# Altium project dust-measure-device.PrjPcb
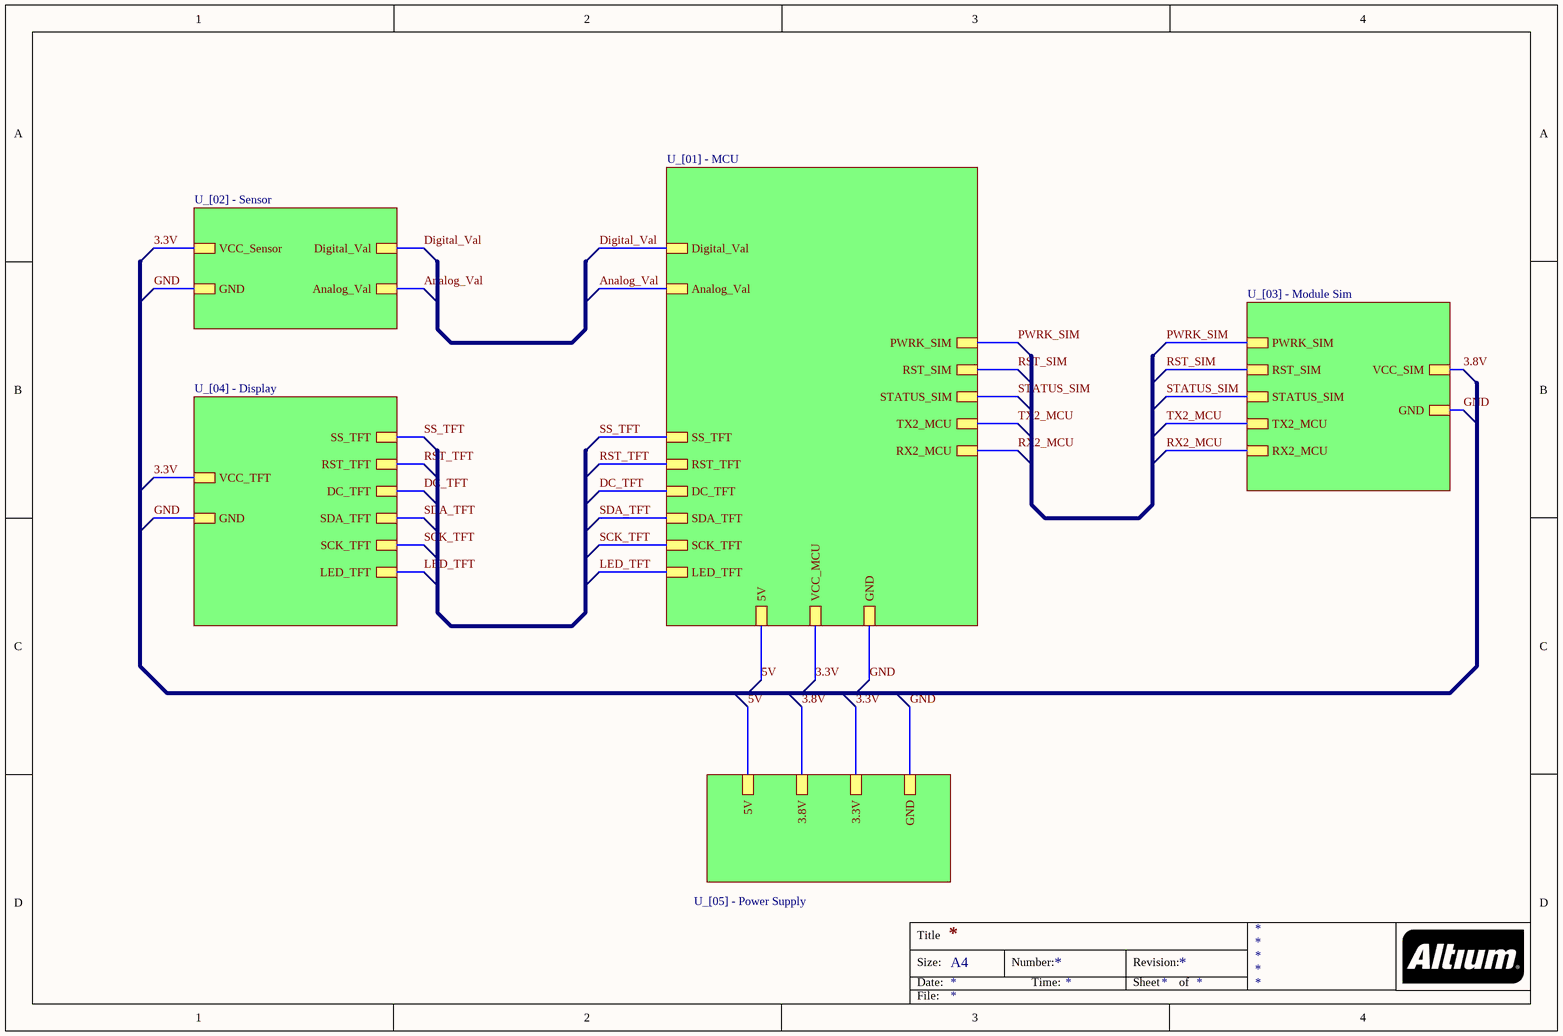
[diagram p0: [00] - Block Sheet.SchDoc]
6 sheets, 93 parts. Net scope: hierarchical (ports join the sheet entries above them; power ports are global).
Board file: dust-measure-device.PcbDoc
Sheets:
  [00] - Block Sheet.SchDoc
    U_[01] - MCU = [01] - MCU.SchDoc
    U_[02] - Sensor = [02] - Sensor.SchDoc
    U_[03] - Module Sim = [03] - Module Sim.SchDoc
    U_[04] - Display = [04] - Display.SchDoc
    U_[05] - Power Supply = [05] - Power Supply.SchDoc

## Sheet [00] - Block Sheet.SchDoc
size A4

### Sub-sheets
U_[01] - MCU = [01] - MCU.SchDoc: 5V, VCC_MCU, GND, TX2_MCU, RX2_MCU, PWRK_SIM, RST_SIM, STATUS_SIM, Analog_Val, Digital_Val, SS_TFT, SCK_TFT, SDA_TFT, RST_TFT, DC_TFT, LED_TFT
U_[02] - Sensor = [02] - Sensor.SchDoc: VCC_Sensor, GND, Digital_Val, Analog_Val
U_[03] - Module Sim = [03] - Module Sim.SchDoc: VCC_SIM, PWRK_SIM, RST_SIM, GND, STATUS_SIM, TX2_MCU, RX2_MCU
U_[04] - Display = [04] - Display.SchDoc: VCC_TFT, GND, SS_TFT, RST_TFT, DC_TFT, SDA_TFT, SCK_TFT, LED_TFT
U_[05] - Power Supply = [05] - Power Supply.SchDoc: 3.3V, GND, 5V, 3.8V

### Nets
3.3V: sheet U_[01] - MCU/VCC_MCU, sheet U_[02] - Sensor/VCC_Sensor, sheet U_[04] - Display/VCC_TFT, sheet U_[05] - Power Supply/3.3V
3.8V: sheet U_[03] - Module Sim/VCC_SIM, sheet U_[05] - Power Supply/3.8V
5V: sheet U_[01] - MCU/5V, sheet U_[05] - Power Supply/5V
GND: sheet U_[01] - MCU/GND, sheet U_[02] - Sensor/GND, sheet U_[03] - Module Sim/GND, sheet U_[04] - Display/GND, sheet U_[05] - Power Supply/GND
Analog_Val: sheet U_[01] - MCU/Analog_Val, sheet U_[02] - Sensor/Analog_Val
DC_TFT: sheet U_[01] - MCU/DC_TFT, sheet U_[04] - Display/DC_TFT
Digital_Val: sheet U_[01] - MCU/Digital_Val, sheet U_[02] - Sensor/Digital_Val
LED_TFT: sheet U_[01] - MCU/LED_TFT, sheet U_[04] - Display/LED_TFT
PWRK_SIM: sheet U_[01] - MCU/PWRK_SIM, sheet U_[03] - Module Sim/PWRK_SIM
RST_SIM: sheet U_[01] - MCU/RST_SIM, sheet U_[03] - Module Sim/RST_SIM
RST_TFT: sheet U_[01] - MCU/RST_TFT, sheet U_[04] - Display/RST_TFT
RX2_MCU: sheet U_[01] - MCU/RX2_MCU, sheet U_[03] - Module Sim/RX2_MCU
SCK_TFT: sheet U_[01] - MCU/SCK_TFT, sheet U_[04] - Display/SCK_TFT
SDA_TFT: sheet U_[01] - MCU/SDA_TFT, sheet U_[04] - Display/SDA_TFT
SS_TFT: sheet U_[01] - MCU/SS_TFT, sheet U_[04] - Display/SS_TFT
STATUS_SIM: sheet U_[01] - MCU/STATUS_SIM, sheet U_[03] - Module Sim/STATUS_SIM  [project net STATUS]
TX2_MCU: sheet U_[01] - MCU/TX2_MCU, sheet U_[03] - Module Sim/TX2_MCU

### Notes on the sheet
- Title
- Size:
- Date:
- A4
- Number:
- Time:
- Revision:
- Sheet
- of
- File:

## Sheet [01] - MCU.SchDoc
size B
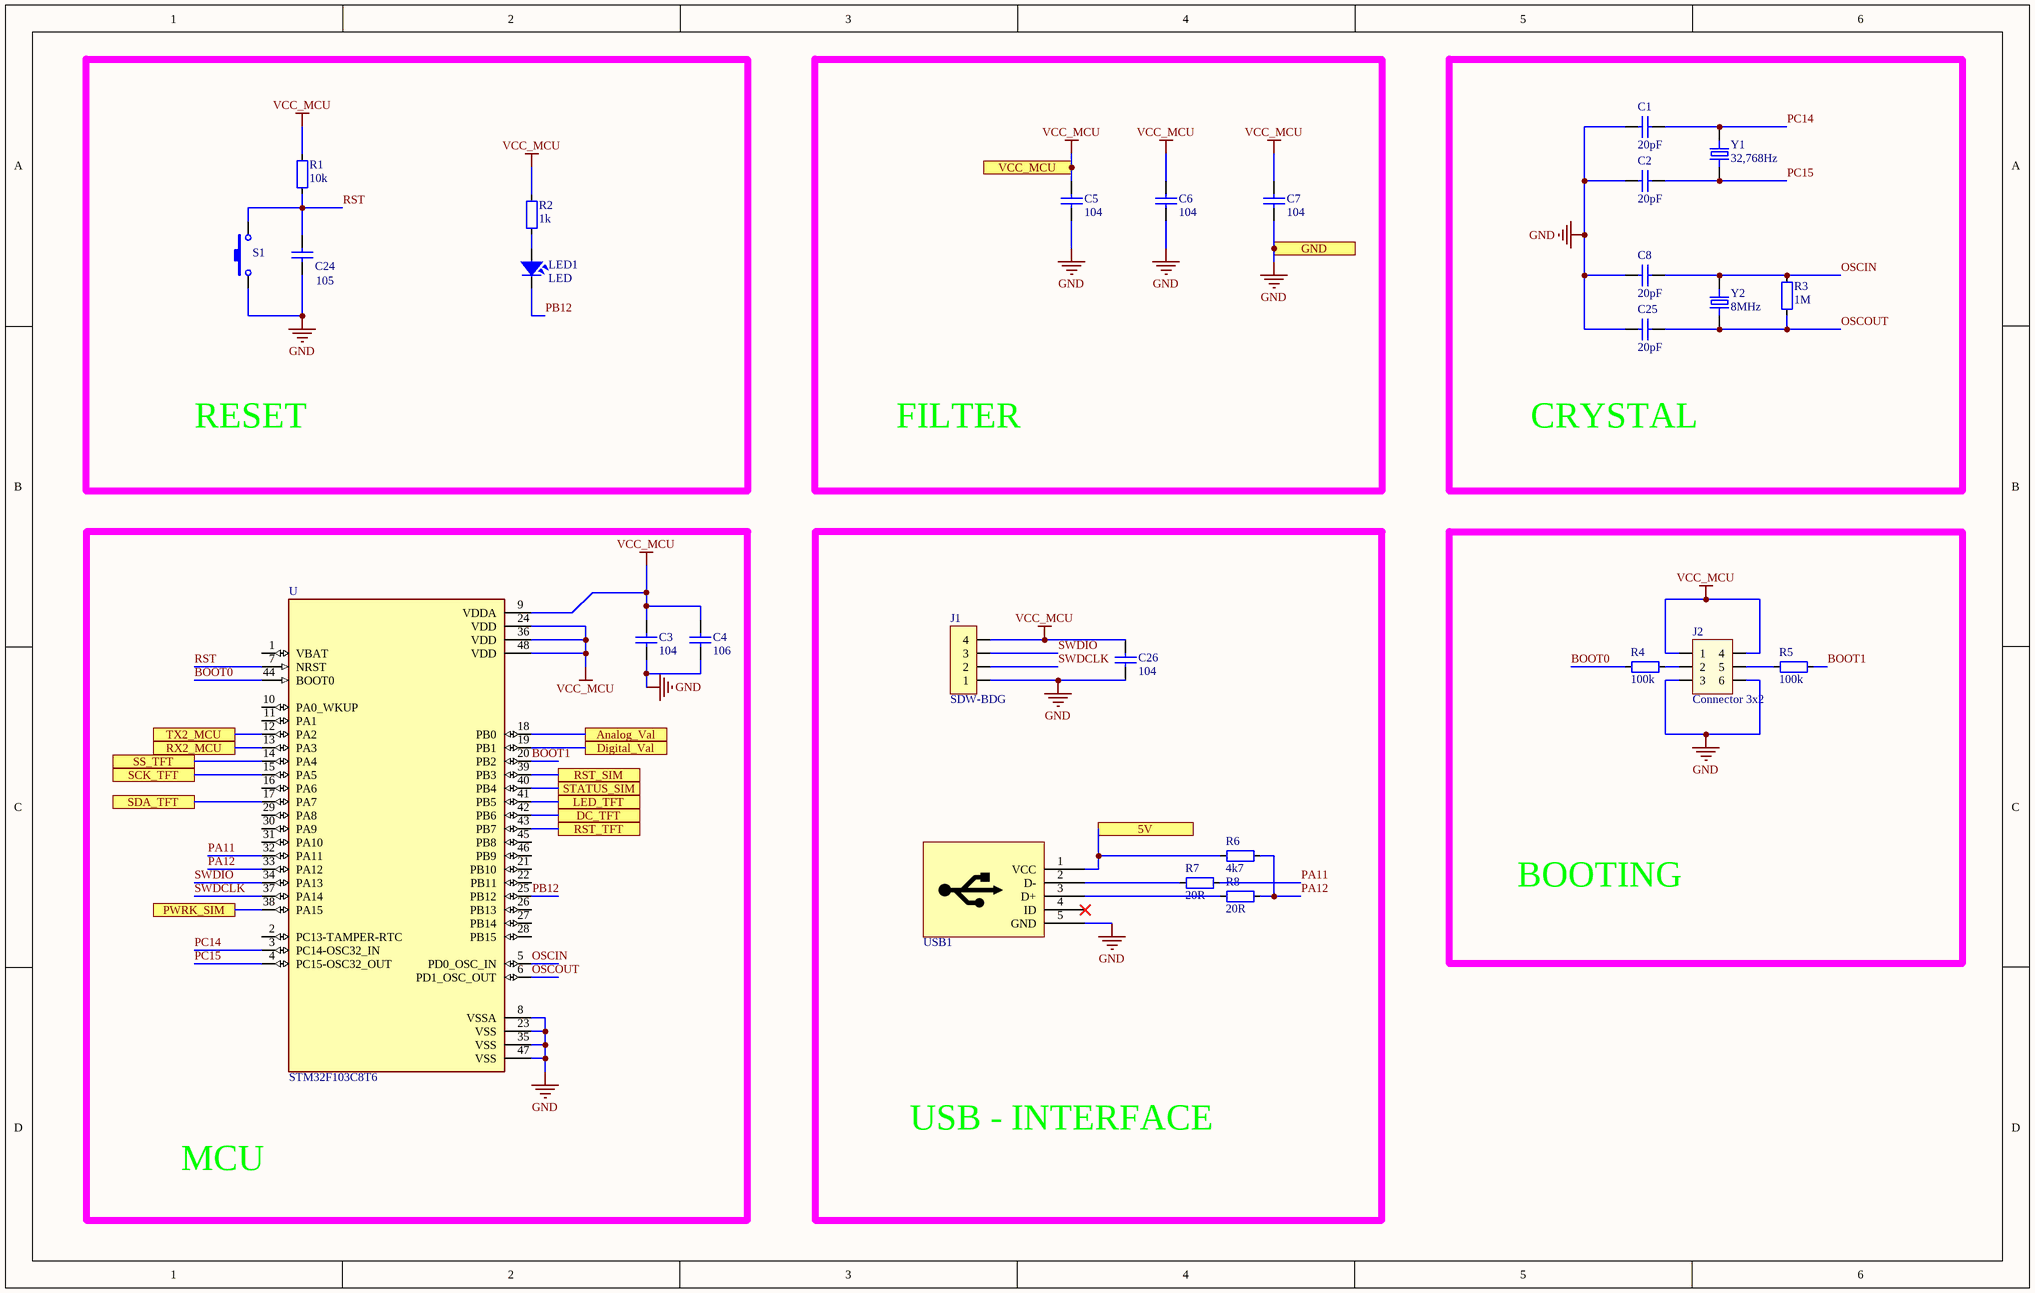
[diagram p1: [01] - MCU.SchDoc]

### Parts
C1  20pF  [CAP_0805]
C2  20pF  [CAP_0805]
C3  104  [CAP_0603]
C4  106  [CAP_1206]
C5  104  [CAP_0603]
C6  104  [CAP_0603]
C7  104  [CAP_0603]
C8  20pF  [CAP_0805]
C24  105  [CAP_0603]
C25  20pF  [CAP_0805]
C26  104  [CAP_0603]
J1  SDW-BDG  [JP4-D1C]
J2  Connector 3x2  [JP3x2]
LED1  LED  [LED-0805-Red]
R1  10k  [RES-SMD-0603]
R2  1k  [RES-SMD-0603]
R3  1M  [RES-SMD-0603]
R4  100k  [RES-SMD-0603]
R5  100k  [RES-SMD-0603]
R6  4k7  [RES-SMD-0603]
R7  20R  [RES-SMD-0603]
R8  20R  [RES-SMD-0603]
S1  SW-SMD  [SW 3x2x4]  (value not drawn)
U  STM32F103C8T6  [STM32F103C8T6]
USB1  USB  [USB-M1]  (value not drawn)
Y1  32,768Hz  [XTAL_ABLS-20.000MHZ-B4-T]
Y2  8MHz  [XTAL_ABLS-20.000MHZ-B4-T]

### Ports
5V, Analog_Val, DC_TFT, Digital_Val, GND, LED_TFT, PWRK_SIM, RST_SIM, RST_TFT, RX2_MCU, SCK_TFT, SDA_TFT, SS_TFT, STATUS_SIM, TX2_MCU, VCC_MCU

### Nets
5V: R6.2 USB1.1(VCC) ; port 5V
GND: C1.1 C2.1 C3.1 C4.1 C5.1 C6.1 C7.1 C8.1 C24.1 C25.1 C26.1 J1.1 J2.3 J2.6 S1.1 U.8(VSSA) U.23(VSS) U.35(VSS) U.47(VSS) USB1.5(GND) ; port GND
VCC_MCU: C3.2 C4.2 C5.2 C6.2 C7.2 C26.2 J1.4 J2.1 J2.4 R1.2 R2.2 U.9(VDDA) U.24(VDD) U.36(VDD) U.48(VDD) ; port VCC_MCU  [project net 3.3V]
Analog_Val: U.18(PB0) ; port Analog_Val
BOOT0: R4.1 U.44(BOOT0)
BOOT1: R5.2 U.20(PB2)
DC_TFT: U.42(PB6) ; port DC_TFT
Digital_Val: U.19(PB1) ; port Digital_Val
LED_TFT: U.41(PB5) ; port LED_TFT
OSCIN: C8.2 R3.2 U.5(PD0_OSC_IN) Y2.2
OSCOUT: C25.2 R3.1 U.6(PD1_OSC_OUT) Y2.1
PA11: R7.2 U.32(PA11)
PA12: R6.1 R8.2 U.33(PA12)
PB12: LED1.2 U.25(PB12)
PC14: C1.2 U.3(PC14-OSC32_IN) Y1.2
PC15: C2.2 U.4(PC15-OSC32_OUT) Y1.1
PWRK_SIM: U.38(PA15) ; port PWRK_SIM
RST: C24.2 R1.1 S1.2 U.7(NRST)
RST_SIM: U.39(PB3) ; port RST_SIM
RST_TFT: U.43(PB7) ; port RST_TFT
RX2_MCU: U.13(PA3) ; port RX2_MCU
SCK_TFT: U.15(PA5) ; port SCK_TFT
SDA_TFT: U.17(PA7) ; port SDA_TFT
SS_TFT: U.14(PA4) ; port SS_TFT
STATUS: U.40(PB4) ; port STATUS_SIM
SWDCLK: J1.2 U.37(PA14)
SWDIO: J1.3 U.34(PA13)
TX2_MCU: U.12(PA2) ; port TX2_MCU
NetJ2_2: J2.2 R4.2
NetJ2_5: J2.5 R5.1
NetLED1_1: LED1.1 R2.1
NetR7_1: R7.1 USB1.2(D-)
NetR8_1: R8.1 USB1.3(D+)

Not connected (* = marked no-connect by the designer): U 1(VBAT) 2(PC13-TAMPER-RTC) 10(PA0_WKUP) 11(PA1) 16(PA6) 21(PB10) 22(PB11) 26(PB13) 27(PB14) 28(PB15) 29(PA8) 30(PA9) 31(PA10) 45(PB8) 46(PB9); USB1 4(ID)*

### Notes on the sheet
- RESET
- FILTER
- CRYSTAL
- BOOTING
- MCU
- USB - INTERFACE
- Title
- Size:
- Date:
- Orcad B
- Number:
- Time:
- Revision:
- Sheet
- of
- File:

### Library data of the parts
C1-C8 C24-C26 = CapSMD: Capacitor; Value: 33p; Published: 8-Jun-2000; LatestRevisionDate: 17-Jul-2002; LatestRevisionNote: Re-released for DXP Platform.; PackageReference: RAD-0.3; Publisher: Altium Limited
J1 = JP4: WR-PHD 2.54 mm Angled Socket Header; Manufacturer: W¨¹rth Elektronik eiSos GmbH; partNo: 613004143121; ComponentLink1 Description: Manufacturer; ComponentLink2 Description: Datasheet; NoPins: 04; Created Date: 29 March 2013; ComponentLink1URL: http://www.we-online.com; ComponentLink2URL: http://katalog.we-online.de/em/datasheet/6130xx143121.pdf; Created by: Karrer Zheng
J2 = JP3x2: Value: Connector 3x2
LED1 = LED: LED Single colour Green and Red; Value: LED 3 ly Single Colour
R1-R8 = Resistor - SMD: Resistor; Manufacturer: Generic Components; Class: Passive; Published: 08/06/2000; Publisher: Altium Hobart Technology Centre
S1 = SW-SMD: Switch; Published: 24-Mar-1999; LatestRevisionDate: 17-Jul-2002; LatestRevisionNote: Re-released for DXP Platform.; PackageReference: SPST-2; Publisher: Altium Limited; ComponentLink1Description: https://shopee.vn/-Home-Living-100pcs-3X6X2.5mm-Tactile-Push-Button-Switch-Tact-Switch-Micro-Switch-SMD-i.329424082.5262213627; ComponentLink1URL: https://shopee.vn/-Home-Living-100pcs-3X6X2.5mm-Tactile-Push-Button-Switch-Tact-Switch-Micro-Switch-SMD-i.329424082.5262213627
U = STM32F103C8T6: ARMÂ® CortexÂ®-M3 STM32F1 Microcontroller IC 32-Bit 72MHz 64KB _64K x 8_ FLASH; MF: STMicroelectronics; Price: None; Package: LQFP-48 STMicroelectronics; Value: *; MP: STM32F103C8T6; Availability: Unavailable; SnapEDA_Link: https://www.snapeda.com/parts/STM32F103C8T6/STMicroelectronics/view-part/52195/?ref=snap
USB1 = USB-micro
Y1 Y2 = Crystal: 8MHz Â±20ppm Crystal 18pF 80 Ohms HC-49/US; MP: ABLS-8.000MHZ-B2; MF: Abracon LLC; Value: *; Package: HC-49/US Abracon LLC; SnapEDA_Link: https://www.snapeda.com/parts/ABLS-8.000MHZ-B2/Abracon%20LLC/view-part/2753215/?ref=snap; Price: None; Availability: Unavailable

## Sheet [02] - Sensor.SchDoc
size A
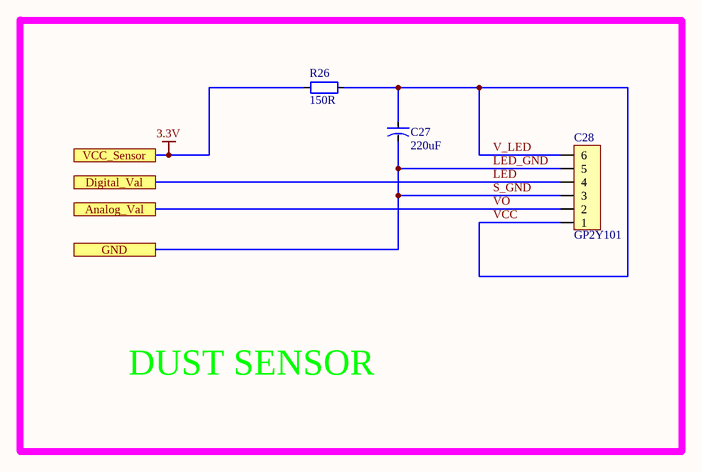
[diagram p2: [02] - Sensor.SchDoc]

### Parts
C27  220uF  [CAP-ALU-SMD-D]
C28  GP2Y101  [CON_6P]
R26  150R  [RES-SMD-0603]

### Ports
Analog_Val, Digital_Val, GND, VCC_Sensor

### Nets
3.3V: R26.1 ; port VCC_Sensor
LED_GND: C27.2 C28.3 C28.5 ; port GND  [also labelled S_GND]  [project net GND]
LED: C28.4 ; port Digital_Val  [project net Digital_Val]
V_LED: C27.1 C28.1 C28.6 R26.2  [also labelled VCC]
VO: C28.2 ; port Analog_Val  [project net Analog_Val]

### Notes on the sheet
- DUST SENSOR

### Library data of the parts
C27 = CAP-ALU-SMD: Polarized Capacitor (Axial); Published: 8-Jun-2000; LatestRevisionDate: 17-Jul-2002; LatestRevisionNote: Re-released for DXP Platform.; PackageReference: POLAR0.8; Publisher: Altium Limited
C28 = Header6: Header IDC, 6 x 1 Pin Vertical 2.54mm Pitch (Non-Boxed, Male); Manufacturer: W¨¹rth Elektronik eiSos GmbH; partNo: 613002143121; ComponentLink1 Description: Manufacturer; ComponentLink2 Description: Datasheet; NoPins: 02; Created Date: 29 March 2013; ComponentLink1URL: http://www.we-online.com; ComponentLink2URL: http://katalog.we-online.de/em/datasheet/6130xx143121.pdf; Created by: Karrer Zheng
R26 = Resistor - SMD: as R1 on sheet [01] - MCU; Published: 08/06/2000; Publisher: Altium Hobart Technology Centre

## Sheet [03] - Module Sim.SchDoc
size 381 x 266 mm
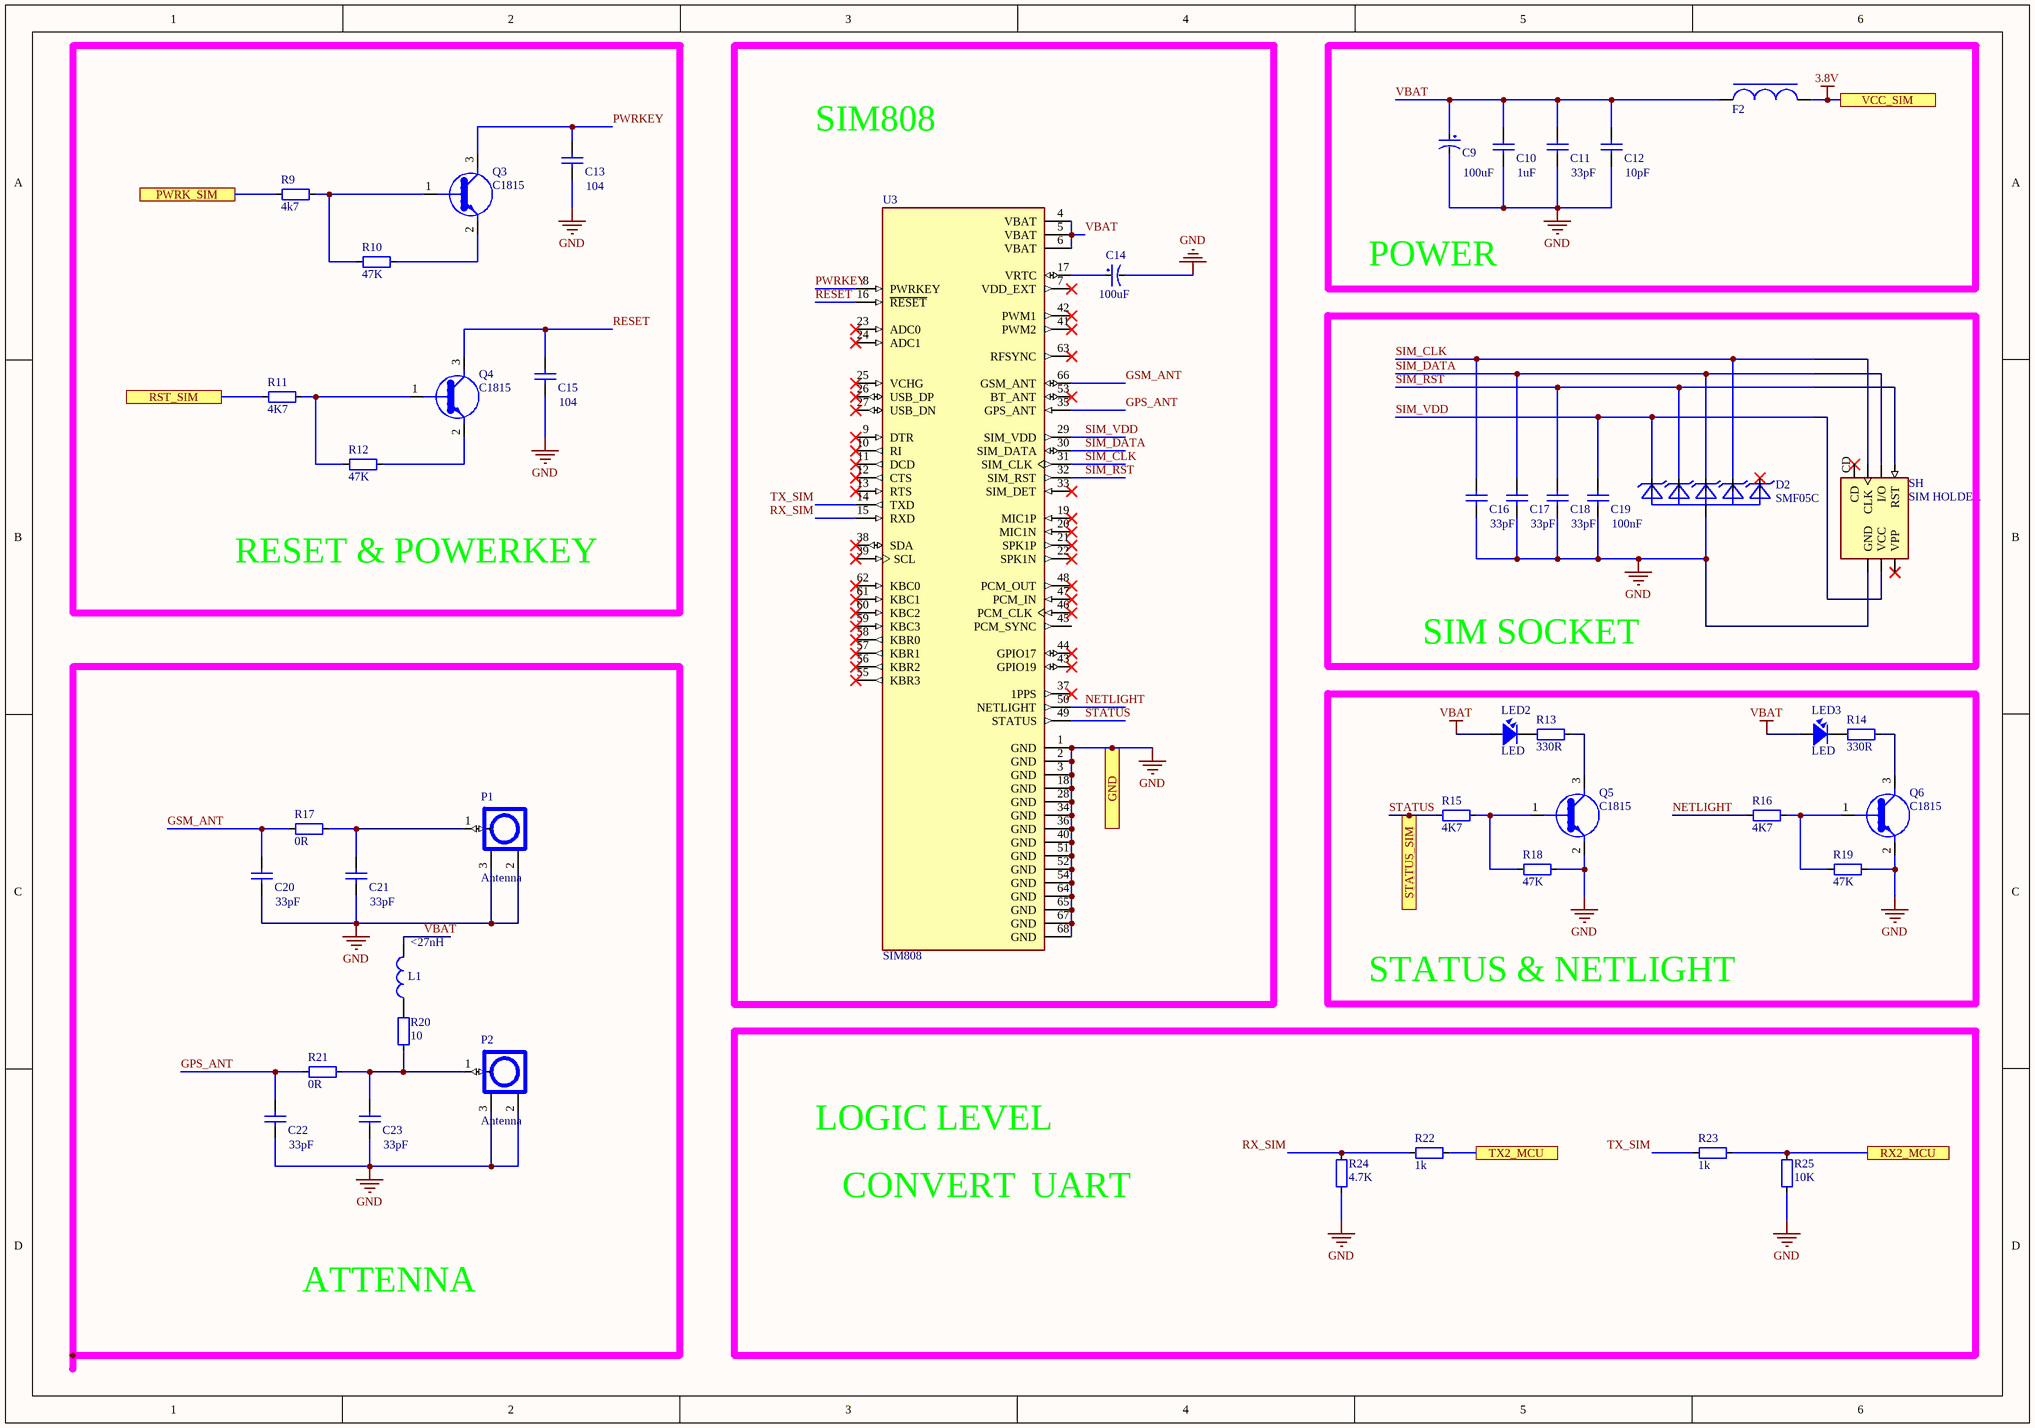
[diagram p3: [03] - Module Sim.SchDoc]

### Parts
C9  100uF  [CAP-ALU-SMD-D]
C10  1uF  [CAP_0805]
C11  33pF  [CAP_0805]
C12  10pF  [CAP_0805]
C13  104  [CAP_0805]
C14  100uF  [CAP-ALU-SMD-D]
C15  104  [CAP_0805]
C16  33pF  [CAP_0805]
C17  33pF  [CAP_0805]
C18  33pF  [CAP_0805]
C19  100nF  [CAP_0805]
C20  33pF  [CAP_0805]
C21  33pF  [CAP_0805]
C22  33pF  [CAP_0805]
C23  33pF  [CAP_0805]
D2  SMF05C  [SC70-6L]
F2  Ferrite Bead  [Ferrite_0805]  (value not drawn)
L1  <27nH  [L-SMD-D-7.3x7.3]
LED2  LED  [LED-0805-Red]
LED3  LED  [LED-0805-Red]
P1  Antenna  [IPXS]
P2  Antenna  [IPXS]
Q3  C1815  [SOT23]
Q4  C1815  [SOT23]
Q5  C1815  [SOT23]
Q6  C1815  [SOT23]
R9  4k7  [RES-SMD-0805]
R10  47K  [RES-SMD-0805]
R11  4K7  [RES-SMD-0805]
R12  47K  [RES-SMD-0805]
R13  330R  [RES-SMD-0805]
R14  330R  [RES-SMD-0805]
R15  4K7  [RES-SMD-0805]
R16  4K7  [RES-SMD-0805]
R17  0R  [RES-SMD-0603]
R18  47K  [RES-SMD-0805]
R19  47K  [RES-SMD-0805]
R20  10  [RES-SMD-0603]
R21  0R  [RES-SMD-0603]
R22  1k  [RES-SMD-0805]
R23  1k  [RES-SMD-0805]
R24  4.7K  [RES-SMD-0805]
R25  10K  [RES-SMD-0805]
SH  SIM HOLDER  [GCT_SIM7100-6-1-15-00-A_REVC]
U3  SIM808  [XCVR_SIM808]

### Ports
GND, PWRK_SIM, RST_SIM, RX2_MCU, STATUS_SIM, TX2_MCU, VCC_SIM

### Nets
3.8V: F2.2 ; port VCC_SIM
GND: C9.2 C10.1 C11.1 C12.1 C13.1 C14.2 C15.1 C16.1 C17.1 C18.1 C19.1 C20.1 C21.1 C22.1 C23.1 D2.2(A) P1.2 P1.3 P2.2 P2.3 Q5.2(E) Q6.2(E) R18.2 R19.2 R24.1 R25.2 SH.C5(GND) U3.1(GND) U3.2(GND) U3.3(GND) U3.18(GND) U3.28(GND) U3.34(GND) U3.36(GND) U3.40(GND) U3.51(GND) U3.52(GND) U3.54(GND) U3.64(GND) U3.65(GND) U3.67(GND) U3.68(GND) ; port GND
VBAT: C9.1 C10.2 C11.2 C12.2 F2.1 L1.2 LED2.1 LED3.1 U3.4(VBAT) U3.5(VBAT) U3.6(VBAT)
GPS_ANT: C22.2 R21.1 U3.35(GPS_ANT)
GSM_ANT: C20.2 R17.1 U3.66(GSM_ANT)
NETLIGHT: R16.1 U3.50(NETLIGHT)
PWRK_SIM: R9.1 ; port PWRK_SIM
PWRKEY: C13.2 Q3.3(C) U3.8(PWRKEY)
RESET: C15.2 Q4.3(C) U3.16(~{RESET})
RST_SIM: R11.1 ; port RST_SIM
RX2_MCU: R23.1 R25.1 ; port RX2_MCU
RX_SIM: R22.2 R24.2 U3.15(RXD)
SIM_CLK: C16.2 D2.5(C4) SH.C3(CLK) U3.31(SIM_CLK)
SIM_DATA: C17.2 D2.4(C3) SH.C7(I/O) U3.30(SIM_DATA)
SIM_RST: C18.2 D2.3(C2) SH.C2(RST) U3.32(SIM_RST)
SIM_VDD: C19.2 D2.1(C1) SH.C1(VCC) U3.29(SIM_VDD)
STATUS: R15.2 U3.49(STATUS) ; port STATUS_SIM
TX2_MCU: R22.1 ; port TX2_MCU
TX_SIM: R23.2 U3.14(TXD)
NetC14_1: C14.1 U3.17(VRTC)
NetC21_2: C21.2 P1.1 R17.2
NetC23_2: C23.2 P2.1 R20.1 R21.2
NetL1_1: L1.1 R20.2
NetLED2_2: LED2.2 R13.1
NetLED3_2: LED3.2 R14.1
NetQ3_1: Q3.1(B) R9.2 R10.1
NetQ3_2: Q3.2(E) R10.2
NetQ4_1: Q4.1(B) R11.2 R12.1
NetQ4_2: Q4.2(E) R12.2
NetQ5_1: Q5.1(B) R15.1 R18.1
NetQ5_3: Q5.3(C) R13.2
NetQ6_1: Q6.1(B) R16.2 R19.1
NetQ6_3: Q6.3(C) R14.2

Not connected (* = marked no-connect by the designer): D2 6(C5)*; SH C6(VPP)* CD*; U3 7(VDD_EXT)* 9(DTR)* 10(RI)* 11(DCD)* 12(CTS)* 13(RTS)* 19(MIC1P)* 20(MIC1N)* 21(SPK1P)* 22(SPK1N)* 23(ADC0)* 24(ADC1)* 25(VCHG)* 26(USB_DP)* 27(USB_DN)* 33(SIM_DET)* 37(1PPS)* 38(SDA)* 39(SCL)* 41(PWM2)* 42(PWM1)* 43(GPIO19)* 44(GPIO17)* 45(PCM_SYNC) 46(PCM_CLK)* 47(PCM_IN)* 48(PCM_OUT)* 53(BT_ANT)* 55(KBR3)* 56(KBR2)* 57(KBR1)* 58(KBR0)* 59(KBC3)* 60(KBC2)* 61(KBC1)* 62(KBC0)* 63(RFSYNC)*

### Notes on the sheet
- SIM808
- POWER
- RESET & POWERKEY
- SIM SOCKET
- STATUS & NETLIGHT
- LOGIC LEVEL
- CONVERT
- UART
- ATTENNA

### Library data of the parts
C9 C14 = Cap_ALU_Smd: Capacitor ALU SMD
C10-C13 C15-C23 = CapSMD: Capacitor; Value: 33p; Published: 8-Jun-2000; LatestRevisionDate: 17-Jul-2002; LatestRevisionNote: Re-released for DXP Platform.; PackageReference: RAD-0.3; Publisher: Altium Limited
D2 = SMF05C: 12.5V Clamp 8A _8/20Âµs_ Ipp Tvs Diode Surface Mount SC-88/SC70-6/SOT-363; Manufacturer: Semtech; Manufacturer Part Number: SMF05C.TCT; MF: ON Semiconductor; Direction: Unidirectional; Capacitance: 130pF; Reverse Breakdown Voltage: 6V; Number of Elements: 5; Element Configuration: Common Anode; Reverse Standoff Voltage: 5V; Peak Pulse Power: 100W; Power Line Protection: No; Leakage Current: 5uA; Test Current: 1mA; ESD Protection: Yes; Diode Type: ZENER; Availability: Unavailable; Price: None; Package: SOT-363 ON Semiconductor; Value: *; SnapEDA_Link: https://www.snapeda.com/parts/SMF05C/ON%20Semiconductor/view-part/2782704/?ref=snap; MP: SMF05C; Supplier 1: Digi-Key; Stock 1: 29664; Pricing 1: 1=0.87, 10=0.762, 100=0.5844, 500=0.462, 1000=0.3696 (USD); Mount: Surface Mount; Case/Package: SC; Number of Pins: 6; Min Operating Temperature: -55°C; Max Operating Temperature: 125°C; Packaging: Tape and Reel; Number of Channels: 5; Number of Unidirectional Channels: 5; Min Breakdown Voltage: 6V; Clamping Voltage: 12.5V; Working Voltage: 5V; Peak Pulse Current: 8A; Polarity: Unidirectional; Max Reverse Leakage Current: 5uA; Max Breakdown Voltage: 6V; Voltage Rating (DC): 5V; Operating Supply Voltage: 5V; Resistor Type: Zener; Series: SMF; Clamping Voltage-Max: 12.5V; Length: 2mm; Width: 1.25mm; Height: 0.9mm; Depth: 1.25mm; Radiation Hardening: No; Lead Free: Lead Free; RoHS Compliant: Yes; ComponentLink1URL: http://www.semtech.com/images/datasheet/smf05c.pdf?src-supplier=Future+Electronics; ComponentLink1Description: http://www.semtech.com/images/datasheet/smf05c.pdf?src-supplier=Future+Electronics; ComponentLink2URL: https://www.semtech.com/uploads/documents/smf05c.pdf?src-supplier=Verical; ComponentLink2Description: https://www.semtech.com/uploads/documents/smf05c.pdf?src-supplier=Verical; ComponentLink3URL: https://www.semtech.com/uploads/documents/smf05c.pdf?src-supplier=Digi-Key; ComponentLink3Description: https://www.semtech.com/uploads/documents/smf05c.pdf?src-supplier=Digi-Key; Supplier Part Number 1: SMF05CDKR-ND; ComponentLink4Description: https://banlinhkien.com/smf05c-sot363-tvs-diode-esd-protection-p6646402.html; ComponentLink4URL: https://banlinhkien.com/smf05c-sot363-tvs-diode-esd-protection-p6646402.html
F2 = Ferrite Bead: Manufacturer: Murata; Manufacturer Part Number: BLM21PG300SN1D; Material: Steel,Ferrite; Frequency: 100MHz; Resistance: 15mR; Tolerance: 25%; Impedance: 30R; Max Current Rating: 4A; Number of Lines: 1; DC Resistance (DCR): 14mR; Max DC Current: 3A; Shielding: Unshielded; Stock 1: 0; Pricing 1: 4000=0.03102, 8000=0.02895, 12000=0.02688, 28000=0.02657, 100000=0.02585 (USD); Case/Package: 0805; Number of Pins: 2; Core Material: Ferrite; Case Code (Metric): 2012; Case Code (Imperial): 0805; Min Operating Temperature: -55°C; Max Operating Temperature: 125°C; Packaging: Tape and Reel; Package Quantity: 1; Current Rating: 4A; Termination: SMD/SMT; Test Frequency: 100MHz; DC Current: 3A; Number of Circuits: 1; Series: BLM21P; DC Resistance-Max: 14mR; Length: 2mm; Width: 1.25mm; Height: 0.85mm; Depth: 1.25mm; Radiation Hardening: No; Lead Free: Lead Free; RoHS Compliant: Yes; REACH SVHC: No SVHC; Military Standard: Not; ComponentLink1URL: http://search.murata.co.jp/Ceramy/image/img/PDF/ENG/L0110S0100BLM21P.pdf?src-supplier=Avnet; ComponentLink1Description: http://search.murata.co.jp/Ceramy/image/img/PDF/ENG/L0110S0100BLM21P.pdf?src-supplier=Avnet; ComponentLink2URL: https://www.murata.com/en-us/products/productdata/8796738977822/ENFA0005.pdf?src-supplier=Digi-Key; ComponentLink2Description: https://www.murata.com/en-us/products/productdata/8796738977822/ENFA0005.pdf?src-supplier=Digi-Key; ComponentLink3URL: http://www.farnell.com/datasheets/1756152.pdf?src-supplier=Element14; ComponentLink3Description: http://www.farnell.com/datasheets/1756152.pdf?src-supplier=Element14; ComponentLink4URL: http://uk.rs-online.com/webdocs/002e/0900766b8002e1f1.pdf?src-supplier=RSComponents; ComponentLink4Description: http://uk.rs-online.com/webdocs/002e/0900766b8002e1f1.pdf?src-supplier=RSComponents; ComponentLink5URL: http://www.murata.com/en-global/api/pdfdownloadapi?cate=luNoiseSupprFilteChipFerriBead&partno=BLM21PG300SN1%23&src-supplier=Future+Electronics; ComponentLink5Description: http://www.murata.com/en-global/api/pdfdownloadapi?cate=luNoiseSupprFilteChipFerriBead&partno=BLM21PG300SN1%23&src-supplier=Future+Electronics; ComponentLink6URL: http://www.jameco.com/Jameco/Products/ProdDS/1845339.pdf?src-supplier=Jameco; ComponentLink6Description: http://www.jameco.com/Jameco/Products/ProdDS/1845339.pdf?src-supplier=Jameco; ComponentLink7URL: http://search.murata.co.jp/Ceramy/image/img/PDF/ENG/L0110S0100BLM21P.pdf?src-supplier=Avnet+Europe; ComponentLink7Description: http://search.murata.co.jp/Ceramy/image/img/PDF/ENG/L0110S0100BLM21P.pdf?src-supplier=Avnet+Europe; ComponentLink8URL: http://www.produktinfo.conrad.com/datenblaetter/1100000-1199999/001172365-da-01-en-DROSSEL_0805_30R0_2_0X1_25MM_4000ST.pdf?src-supplier=Conrad; ComponentLink8Description: http://www.produktinfo.conrad.com/datenblaetter/1100000-1199999/001172365-da-01-en-DROSSEL_0805_30R0_2_0X1_25MM_4000ST.pdf?src-supplier=Conrad; Supplier 1: Digi-Key; Supplier Part Number 1: 490-1052-2-ND; ComponentLink9Description: https://banlinhkien.vn/goods-9788-ferrite-beads-100-ohm-nfz2msm101sn10l.htmlhttps://banlinhkien.vn/goods-9788-ferrite-beads-100-ohm-nfz2msm101sn10l.html; ComponentLink9URL: https://banlinhkien.vn/goods-9788-ferrite-beads-100-ohm-nfz2msm101sn10l.html
L1 = Inductor
LED2 LED3 = LED: as LED1 on sheet [01] - MCU
P1 P2 = IPXSx66: Antenna GSM GPS
Q3-Q6 = C1815: Bipolar _BJT_ Transistor NPN 25V 1.5A 100MHz 300mW Surface Mount SOT-23; Manufacturer: MCC; Manufacturer Part Number: MMSS8050-L-TP; MF: Comchip Technology; MP: SS8050-G; hFE Min: 40; Max Power Dissipation: 625mW; Collector Emitter Voltage (VCEO): 500mV; Collector Base Voltage (VCBO): 40V; Emitter Base Voltage (VEBO): 5V; Element Configuration: Single; Value: *; Digi-Key_Purchase_URL: https://www.digikey.in/product-detail/en/comchip-technology/SS8050-G/641-1790-1-ND/6138954?utm_source=snapeda&utm_medium=aggregator&utm_campaign=symbol; Package: TO-236 Comchip; SnapEDA_Link: https://www.snapeda.com/parts/SS8050-G/Comchip%20Technology/view-part/809142/?ref=snap; Digi-Key_Part_Number: 641-1790-1-ND; Supplier 1: Digi-Key; Stock 1: 0; Pricing 1: 3000=0.0346, 6000=0.03121, 15000=0.02714, 30000=0.02442, 75000=0.02171 (USD); Mount: Surface Mount; Case/Package: TO-236-3; Min Operating Temperature: -55°C; Max Operating Temperature: 150°C; Packaging: Tape and Reel; Package Quantity: 3000; Max Collector Current: 1.5A; Transition Frequency: 100MHz; Polarity: NPN; Collector Emitter Saturation Voltage: 500mV; Collector Emitter Breakdown Voltage: 25V; Max Breakdown Voltage: 25V; Gain Bandwidth Product: 100MHz; Series: -; Collector-emitter Voltage-Max: 500mV; Lead Free: Lead Free; RoHS Compliant: Yes; ComponentLink1URL: http://www.mouser.com/ds/2/258/MMSS8050(SOT-23)-276387.pdf?src-supplier=Mouser; ComponentLink1Description: http://www.mouser.com/ds/2/258/MMSS8050(SOT-23)-276387.pdf?src-supplier=Mouser; ComponentLink2URL: http://www.mccsemi.com/up_pdf/MMSS8050(SOT-23).pdf?src-supplier=Digi-Key; ComponentLink2Description: http://www.mccsemi.com/up_pdf/MMSS8050(SOT-23).pdf?src-supplier=Digi-Key; ComponentLink3URL: https://www.mccsemi.com/pdf/Products/MMSS8050(SOT-23).pdf?src-supplier=Digi-Key; ComponentLink3Description: https://www.mccsemi.com/pdf/Products/MMSS8050(SOT-23).pdf?src-supplier=Digi-Key; Supplier Part Number 1: MMSS8050-L-TPMSTR-ND; ComponentLink4Description: https://banlinhkien.vn/goods-946-c1815-2sc1815-sot23-npn-hf-smd-.html; ComponentLink4URL: https://banlinhkien.vn/goods-946-c1815-2sc1815-sot23-npn-hf-smd-.html
R9-R25 = Resistor - SMD: as R1 on sheet [01] - MCU; Published: 08/06/2000; Publisher: Altium Hobart Technology Centre
SH = SIM HOLDER: 7 _6 + 1_ Position Card Connector Micro SIM Surface Mount, Right Angle Gold; MP: SIM7100-6-1-15-00-A; MF: Global Connector Technology; Package: None; Availability: Unavailable; SnapEDA_Link: https://www.snapeda.com/parts/SIM7100-6-1-15-00-A/Global%20Connector%20Technology/view-part/449163/?ref=snap; Price: None; Value: *
U3 = SIM808: SIM808 GPS, GPRS/GSM RF Arduino Platform Evaluation Expansion Board; MF: Adafruit Industries; MP: SIM808; Package: None; SnapEDA_Link: https://www.snapeda.com/parts/SIM808/SIMcom%20Wireless%20solutions%20Co.%2CLtd/view-part/424834/?ref=snap; Availability: Unavailable; Price: None; Value: *; ComponentLink1Description: https://banlinhkien.com/sim808-p6650749.html; ComponentLink1URL: https://banlinhkien.com/sim808-p6650749.html

## Sheet [04] - Display.SchDoc
size A
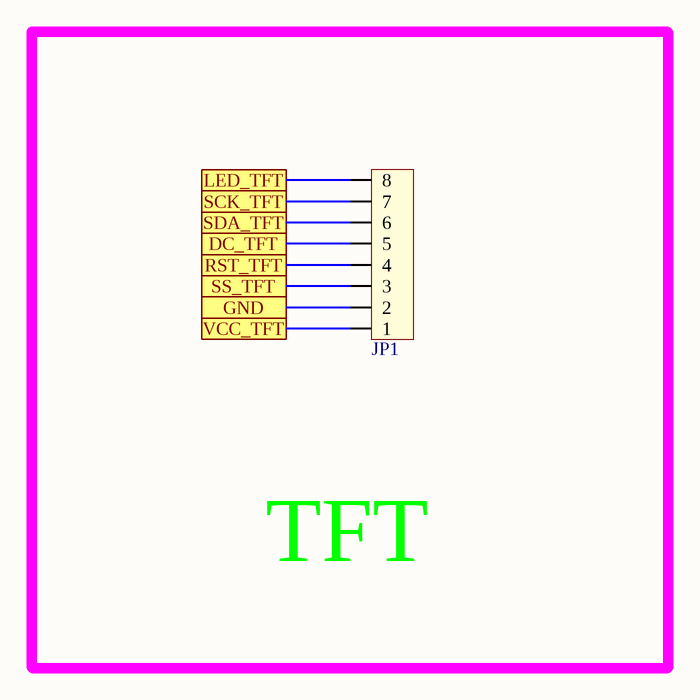
[diagram p4: [04] - Display.SchDoc]

### Parts
JP1  Conn-8  [CON_8P]  (value not drawn)

### Ports
DC_TFT, GND, LED_TFT, RST_TFT, SCK_TFT, SDA_TFT, SS_TFT, VCC_TFT

### Nets
3.3V: JP1.1 ; port VCC_TFT
GND: JP1.2 ; port GND
DC_TFT: JP1.5 ; port DC_TFT
LED_TFT: JP1.8 ; port LED_TFT
RST_TFT: JP1.4 ; port RST_TFT
SCK_TFT: JP1.7 ; port SCK_TFT
SDA_TFT: JP1.6 ; port SDA_TFT
SS_TFT: JP1.3 ; port SS_TFT

### Notes on the sheet
- TFT

## Sheet [05] - Power Supply.SchDoc
size B
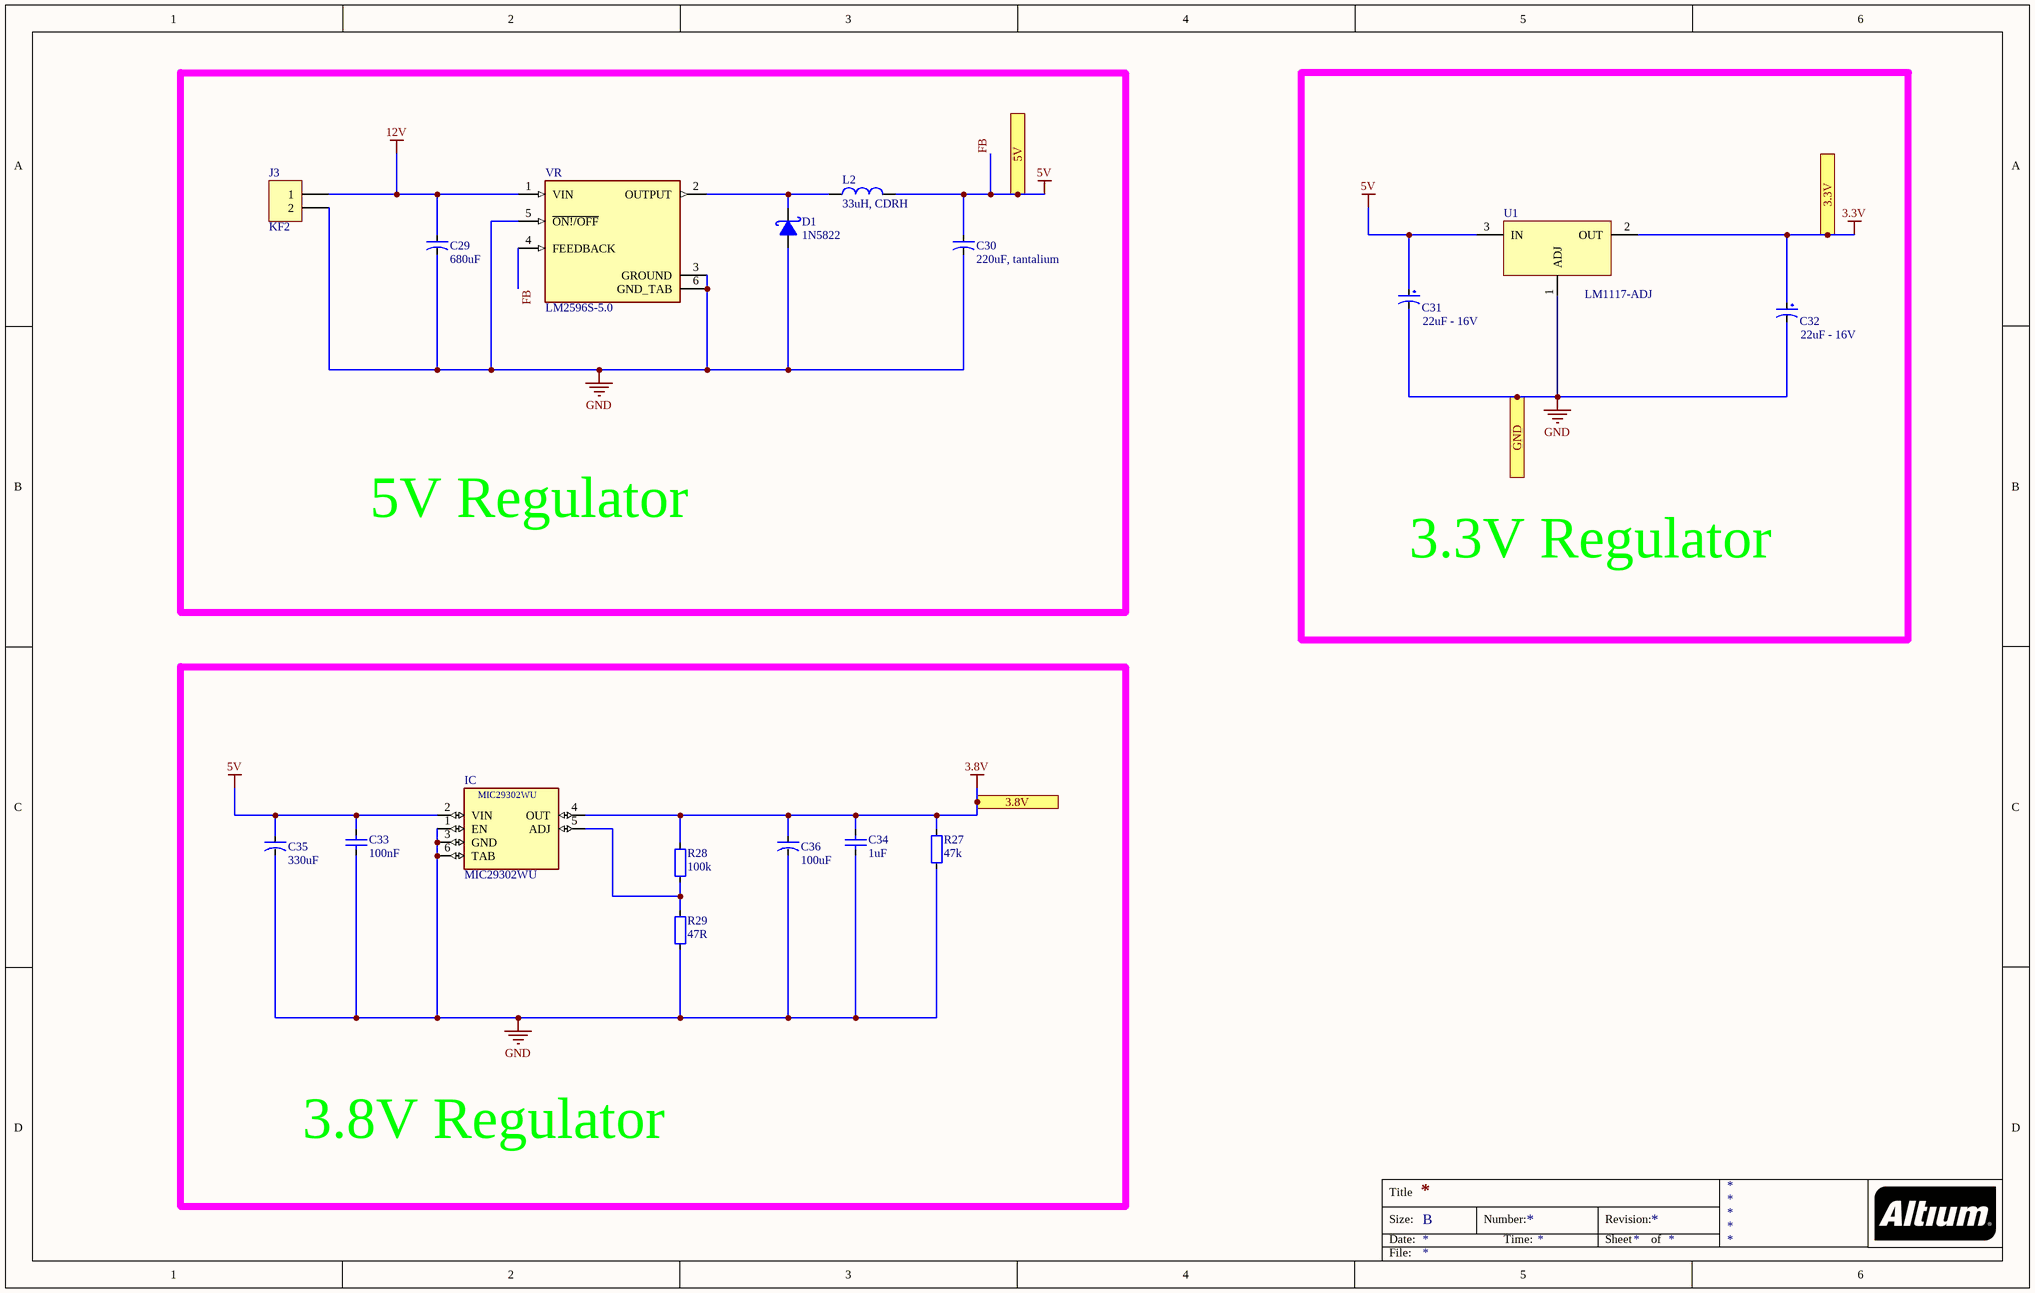
[diagram p5: [05] - Power Supply.SchDoc]

### Parts
C29  680uF  [CAP-ALU-SMD-D]
C30  220uF, tantalium  [CAP-ALU-SMD-D]
C31  22uF - 16V  [CAP-ALU-SMD-D]
C32  22uF - 16V  [CAP-ALU-SMD-D]
C33  100nF  [CAP_0805]
C34  1uF  [CAP_0805]
C35  330uF  [CAP-ALU-SMD-D]
C36  100uF  [CAP-ALU-SMD-D]
D1  1N5822  [B560C-13-F]
IC  MIC29302WU  [TO-263]
J3  KF2  [KF2-7.62]
L2  33uH, CDRH  [Inductor_SMD]
R27  47k  [RES-SMD-0603]
R28  100k  [RES-SMD-0603]
R29  47R  [RES-SMD-0603]
U1  LM1117-ADJ  [LM1117-SOP]
VR  LM2596S-5.0  [TO170P1524X483-6N]

### Ports
3.3V, 3.8V, 5V, GND

### Nets
3.3V: C32.1 U1.2(OUT) ; port 3.3V
3.8V: C34.2 C36.1 IC.4(OUT) R27.2 R28.2 ; port 3.8V
5V: C30.1 C31.1 C33.2 C35.1 IC.2(VIN) L2.2 U1.3(IN) VR.4(FEEDBACK) ; port 5V  [also labelled FB]
12V: C29.1 J3.1 VR.1(VIN)
GND: C29.2 C30.2 C31.2 C32.2 C33.1 C34.1 C35.2 C36.2 D1.1(A) IC.1(EN) IC.3(GND) IC.6(TAB) J3.2 R27.1 R29.1 U1.1(ADJ) VR.3(GROUND) VR.5(~{ON!/OFF}) VR.6(GND_TAB) ; port GND
NetD1_2: D1.2(K) L2.1 VR.2(OUTPUT)
NetIC_5: IC.5(ADJ) R28.1 R29.2

### Notes on the sheet
- 5V Regulator
- 3.3V Regulator
- 3.8V Regulator
- Title
- Size:
- Date:
- B
- Number:
- Time:
- Revision:
- Sheet
- of
- File:

### Library data of the parts
C29 C30 C35 C36 = CAP-ALU-SMD: Polarized Capacitor (Axial); Published: 8-Jun-2000; LatestRevisionDate: 17-Jul-2002; LatestRevisionNote: Re-released for DXP Platform.; PackageReference: POLAR0.8; Publisher: Altium Limited
C31 C32 = Cap_ALU_Smd: Capacitor ALU SMD; ComponentLink1Description: http://linhkienviet.vn/tu-nhom-22uf-25v-5x5-4mm; ComponentLink1URL: http://linhkienviet.vn/tu-nhom-22uf-25v-5x5-4mm
C33 C34 = CapSMD: Capacitor; Value: 33p; Published: 8-Jun-2000; LatestRevisionDate: 17-Jul-2002; LatestRevisionNote: Re-released for DXP Platform.; PackageReference: RAD-0.3; Publisher: Altium Limited
D1 = 1N5822: Schottky Rectifiers; Value: Diode c?m 1N5408
IC = MIC29302WU: Linear Voltage Regulator IC 1 Output 3A TO-263-5; MF: Microchip Technology; Package: TO-263-6 Microchip Technology; Price: None; MP: MIC29302WU; Availability: Unavailable; SnapEDA_Link: https://www.snapeda.com/parts/MIC29302WU/Microchip/view-part/4422516/?ref=snap; Value: *
J3 = KF2: Manufacturer: Würth Elektronik eiSos GmbH; partNo: 691103110002; ComponentLink1 Description: Manufacturer; ComponentLink2 Description: Datasheet; NoPins: 2; Created Date: 29 October 2013; ComponentLink1URL: http://www.we-online.com; ComponentLink2URL: http://katalog.we-online.de/em/datasheet/6911031100xx.pdf; Created by: Karrer Zheng
L2 = L1: Inductor; Value: 150 mH
R27-R29 = Resistor - SMD: as R1 on sheet [01] - MCU; Published: 08/06/2000; Publisher: Altium Hobart Technology Centre
U1 = LM1117-ADJ: 800mA Low-Dropout Linear Regulator; Creator: Nguyen Ba Bien; Website: http://group3i.net
VR = LM2596S-5.0: SIMPLE SWITCHER&reg; 4.5V to 40V, 3A Low Component Count Step-Down Regulator 5-DDPAK/TO-263; MF: Texas Instruments; MP: LM2596S-5.0/NOPB; DigiKey-Purchase-URL: https://snapeda.com/shop?store=DigiKey&id=15588; Mouser-Purchase-URL: https://snapeda.com/shop?store=Mouser&id=15588; SnapEDA_Link: https://www.snapeda.com/parts/LM2596S-5.0/NOPB/Texas%20Instruments/view-part/15588/?ref=snap; Price: None; Value: *; Availability: Good; Texas_Instruments-Purchase-URL: https://snapeda.com/shop?store=Texas+Instruments&id=15588; Package: TO-263-5 Texas Instruments

## Nets that join several sheets
3.3V: [01] - MCU (15 pins), [02] - Sensor (R26.1), [04] - Display (JP1.1), [05] - Power Supply (C32.1 U1.2)
3.8V: [03] - Module Sim (F2.2), [05] - Power Supply (5 pins)
5V: [01] - MCU (R6.2 USB1.1), [05] - Power Supply (8 pins)
GND: [01] - MCU (20 pins), [02] - Sensor (C27.2 C28.3 C28.5), [03] - Module Sim (42 pins), [04] - Display (JP1.2), [05] - Power Supply (19 pins)
Analog_Val: [01] - MCU (U.18), [02] - Sensor (C28.2)
DC_TFT: [01] - MCU (U.42), [04] - Display (JP1.5)
Digital_Val: [01] - MCU (U.19), [02] - Sensor (C28.4)
LED_TFT: [01] - MCU (U.41), [04] - Display (JP1.8)
PWRK_SIM: [01] - MCU (U.38), [03] - Module Sim (R9.1)
RST_SIM: [01] - MCU (U.39), [03] - Module Sim (R11.1)
RST_TFT: [01] - MCU (U.43), [04] - Display (JP1.4)
RX2_MCU: [01] - MCU (U.13), [03] - Module Sim (R23.1 R25.1)
SCK_TFT: [01] - MCU (U.15), [04] - Display (JP1.7)
SDA_TFT: [01] - MCU (U.17), [04] - Display (JP1.6)
SS_TFT: [01] - MCU (U.14), [04] - Display (JP1.3)
STATUS: [01] - MCU (U.40), [03] - Module Sim (R15.2 U3.49)
TX2_MCU: [01] - MCU (U.12), [03] - Module Sim (R22.1)